# EAGLE design Main_Board (EAGLE 6.0)
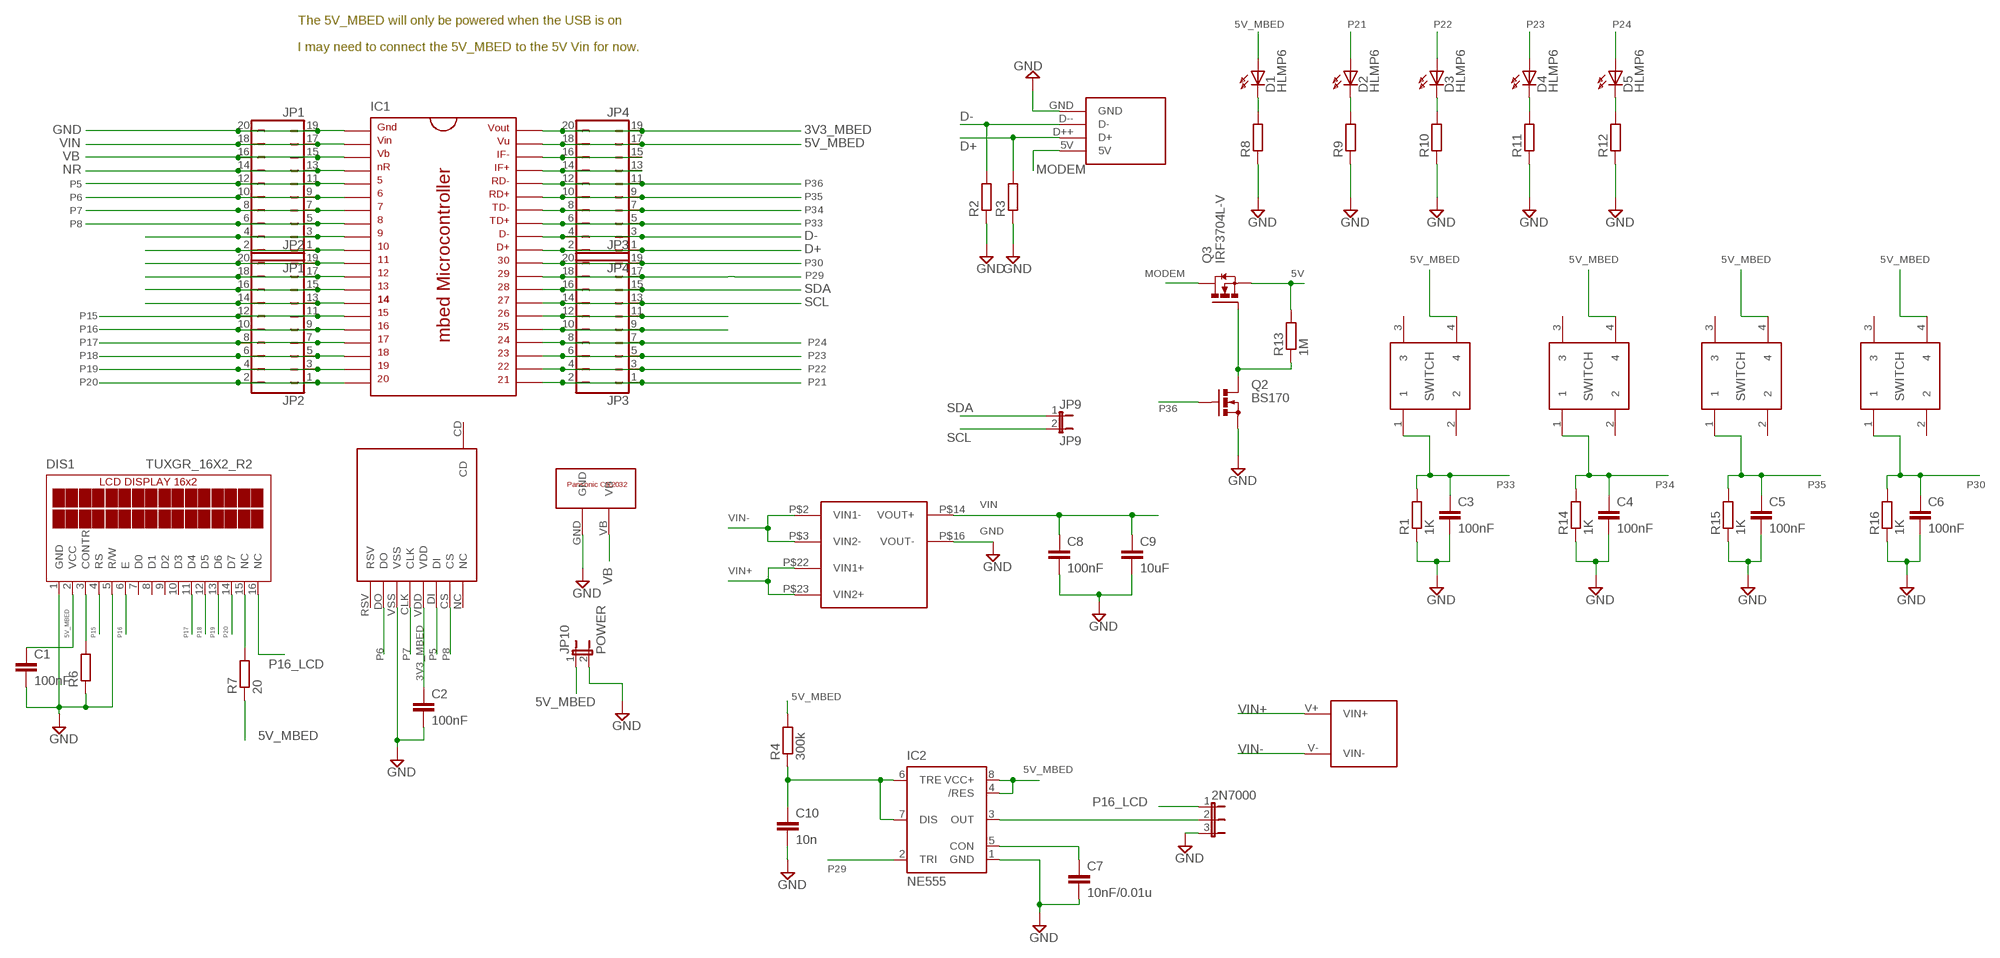
[diagram p0: schematic, sheet 1]

## Parts
2N7000  JP2E  [JP2]
C1  100nF  C5/3  [C5B3]
C2  100nF  C5/3  [C5B3]
C3  100nF  C5/3  [C5B3]
C4  100nF  C5/3  [C5B3]
C5  100nF  C5/3  [C5B3]
C6  100nF  C5/3  [C5B3]
C7  10nF/0.01u  C5/3  [C5B3]
C8  100nF  C5/3  [C5B3]
C9  10uF  C5/3  [C5B3]
C10  10n  C5/3  [C5B3]
D1  HLMP6  [HLMP6]
D2  HLMP6  [HLMP6]
D3  HLMP6  [HLMP6]
D4  HLMP6  [HLMP6]
D5  HLMP6  [HLMP6]
DIS1  TUXGR_16X2_R2  [TUXGR_16X2_R2]
IC1  MBED_MICROCONTROLLER  [DIL40_0.9]
IC2  NE555  [DIL-08]
JP1  JP1  JP10Q  [JP10Q]
JP2  JP2  JP10Q  [JP10Q]
JP3  JP3  JP10Q  [JP10Q]
JP4  JP4  JP10Q  [JP10Q]
JP9  JP9  JP1E  [JP1]
JP10  POWER  JP1E  [JP1]
Q2  BS170  [SOT54E]
Q3  IRF3704L-V  [TO262-V]
R1  1K  R-EU_0411/12  [0411/12]
R2  R-EU_0411/12  [0411/12]
R3  R-EU_0411/12  [0411/12]
R4  300k  R-EU_0411/12  [0411/12]
R6  R-EU_0411/12  [0411/12]
R7  20  R-EU_0411/12  [0411/12]
R8  R-EU_0411/12  [0411/12]
R9  R-EU_0411/12  [0411/12]
R10  R-EU_0411/12  [0411/12]
R11  R-EU_0411/12  [0411/12]
R12  R-EU_0411/12  [0411/12]
R13  1M  R-EU_0411/12  [0411/12]
R14  1K  R-EU_0411/12  [0411/12]
R15  1K  R-EU_0411/12  [0411/12]
R16  1K  R-EU_0411/12  [0411/12]
U$1  USBA_SOCKET  [USBA_SOCKET]
U$2  MICROSD_SOCKET  [MICROSD_SOCKET]
U$3  PANASONIC_CR2032  [PANASONIC_CR2032]
U$4  INPUT_VOLTAGE_CONNECTOR  [INPUT_VOLTAGE_CONNECTOR]
U$5  TACT_SWITCH  [TACT_SWITCH]
U$6  TACT_SWITCH  [TACT_SWITCH]
U$7  TACT_SWITCH  [TACT_SWITCH]
U$8  TACT_SWITCH  [TACT_SWITCH]
U$9  TRACO_ISOLATED_SUPPLY  [TRACO_ISOLATED_SUPPLY]

## Nets
3V3_MBED: C2.1 IC1.40 JP4.19 JP4.20 U$2.VDD
5V: Q3.3(S) R13.2
5V_MBED: C1.1 D1.A DIS1.2(VCC) IC1.39 IC2.4(/RES) IC2.8(VCC+) JP4.17 JP4.18 JP10.1 R4.2 R7.1 U$5.4 U$6.4 U$7.4 U$8.4
D+: IC1.31 JP4.1 JP4.2 R3.2 U$1.D++(D+)
D-: IC1.32 JP4.3 JP4.4 R2.2 U$1.D--(D-)
GND: 2N7000.3 C1.2 C2.2 C3.2 C4.2 C5.2 C6.2 C7.2 C8.2 C9.2 C10.2 DIS1.1(GND) DIS1.5(R/W) IC1.1 IC2.1(GND) JP1.19 JP1.20 JP10.2 Q2.S R1.1 R2.1 R3.1 R6.1 R8.1 R9.1 R10.1 R11.1 R12.1 R14.1 R15.1 R16.1 U$1.GND U$2.VSS U$3.GND U$9.P$16(VOUT-)
MODEM: Q3.2(D) U$1.5V
N$1: D1.K R8.2
N$2: C7.1 IC2.5(CON)
N$3: DIS1.3(CONTR) R6.2
N$4: D2.K R9.2
N$5: Q2.D Q3.1(G) R13.1
N$6: C10.1 IC2.6(TRE) IC2.7(DIS) R4.1
N$7: 2N7000.2 IC2.3(OUT)
N$9: IC1.9 JP1.3 JP1.4
N$10: IC1.10 JP1.1 JP1.2
N$11: IC1.11 JP2.19 JP2.20
N$12: IC1.12 JP2.17 JP2.18
N$13: IC1.13 JP2.15 JP2.16
N$14: IC1.14 JP2.13 JP2.14
N$15: D3.K R10.2
N$16: D4.K R11.2
N$17: D5.K R12.2
N$23: IC1.38 JP4.15 JP4.16
N$24: IC1.37 JP4.13 JP4.14
N$35: IC1.26 JP3.11 JP3.12
N$36: IC1.25 JP3.9 JP3.10
N$45: DIS1.15(NC) R7.2
NR: IC1.4 JP1.13 JP1.14
P5: IC1.5 JP1.11 JP1.12 U$2.DI
P6: IC1.6 JP1.9 JP1.10 U$2.DO
P7: IC1.7 JP1.7 JP1.8 U$2.CLK
P8: IC1.8 JP1.5 JP1.6 U$2.CS
P15: DIS1.4(RS) IC1.15 JP2.11 JP2.12
P16: DIS1.6(E) IC1.16 JP2.9 JP2.10
P16_LCD: 2N7000.1 DIS1.16(NC)
P17: DIS1.11(D4) IC1.17 JP2.7 JP2.8
P18: DIS1.12(D5) IC1.18 JP2.5 JP2.6
P19: DIS1.13(D6) IC1.19 JP2.3 JP2.4
P20: DIS1.14(D7) IC1.20 JP2.1 JP2.2
P21: D2.A IC1.21 JP3.1 JP3.2
P22: D3.A IC1.22 JP3.3 JP3.4
P23: D4.A IC1.23 JP3.5 JP3.6
P24: D5.A IC1.24 JP3.7 JP3.8
P29: IC1.29 IC2.2(TRI) JP3.17 JP3.18
P30: C6.1 IC1.30 JP3.19 JP3.20 R16.2 U$8.1
P33: C3.1 IC1.33 JP4.5 JP4.6 R1.2 U$5.1
P34: C4.1 IC1.34 JP4.7 JP4.8 R14.2 U$6.1
P35: C5.1 IC1.35 JP4.9 JP4.10 R15.2 U$7.1
P36: IC1.36 JP4.11 JP4.12 Q2.G
SCL: IC1.27 JP3.13 JP3.14 JP9.2
SDA: IC1.28 JP3.15 JP3.16 JP9.1
VB: IC1.3 JP1.15 JP1.16 U$3.VB
VIN: C8.1 C9.1 IC1.2 JP1.17 JP1.18 U$9.P$14(VOUT+)
VIN+: U$4.V+(VIN+) U$9.P$22(VIN1+) U$9.P$23(VIN2+)
VIN-: U$4.V-(VIN-) U$9.P$2(VIN1-) U$9.P$3(VIN2-)
Unconnected: DIS1.7(D0) DIS1.8(D1) DIS1.9(D2) DIS1.10(D3) U$2.CD U$2.NC U$2.RSV U$5.2 U$5.3 U$6.2 U$6.3 U$7.2 U$7.3 U$8.2 U$8.3

## Notes on the sheet
- The 5V_MBED will only be powered when the USB is on
- I may need to connect the 5V_MBED to the 5V Vin for now.

## Library data of the parts
2N7000 = jumper:JP2E: JUMPER
C1-C10 = capacitor-wima:C: CAPACITOR naming: grid - package width
D1-D5 = display-hp:HLMP6: LED 2mm horizontal; MF: AGILENT TECHNOLOGIES; MPN: HLMP-6500; OC_FARNELL: 1652490; OC_NEWARK: 40K0088
DIS1 = display-lcd3:TUXGR_16X2_R2: Tuxgraphics LCD display 16x2 characters reflective, without background light Source: tuxgr_12x2_r2.pdf; OC_FARNELL: unknown; OC_NEWARK: unknown
IC1 = mbed-microcontroller:MBED_MICROCONTROLLER: mbed Microcontroller, DIP40, 0.9"
IC2 = st-microelectronics:NE555: General purpose bipolar Timer; MF: Arrow Electronics; MPN: NE555N; OC_FARNELL: 1467742; OC_NEWARK: 89K1486
JP1-JP4 = jumper:JP10Q: JUMPER
JP9 JP10 = jumper:JP1E: JUMPER
Q2 = transistor-small-signal:BS170: N-CHANNEL MOS FET
Q3 = transistor-power:IRF3704: SMPS MOSFET HEXFET® Power MOSFET Source: http://www.irf.com/product-info/datasheets/data/irf3704.pdf
R1-R4 R6-R16 = rcl:R-EU_: RESISTOR, European symbol
U$1 = ekohub2013:USBA_SOCKET
U$2 = ekohub2013:MICROSD_SOCKET
U$3 = Datalogging_Custom_Parts:PANASONIC_CR2032
U$4 = ekohub2013:INPUT_VOLTAGE_CONNECTOR
U$5-U$8 = ekohub2013:TACT_SWITCH
U$9 = ekohub2013:TRACO_ISOLATED_SUPPLY

## Board
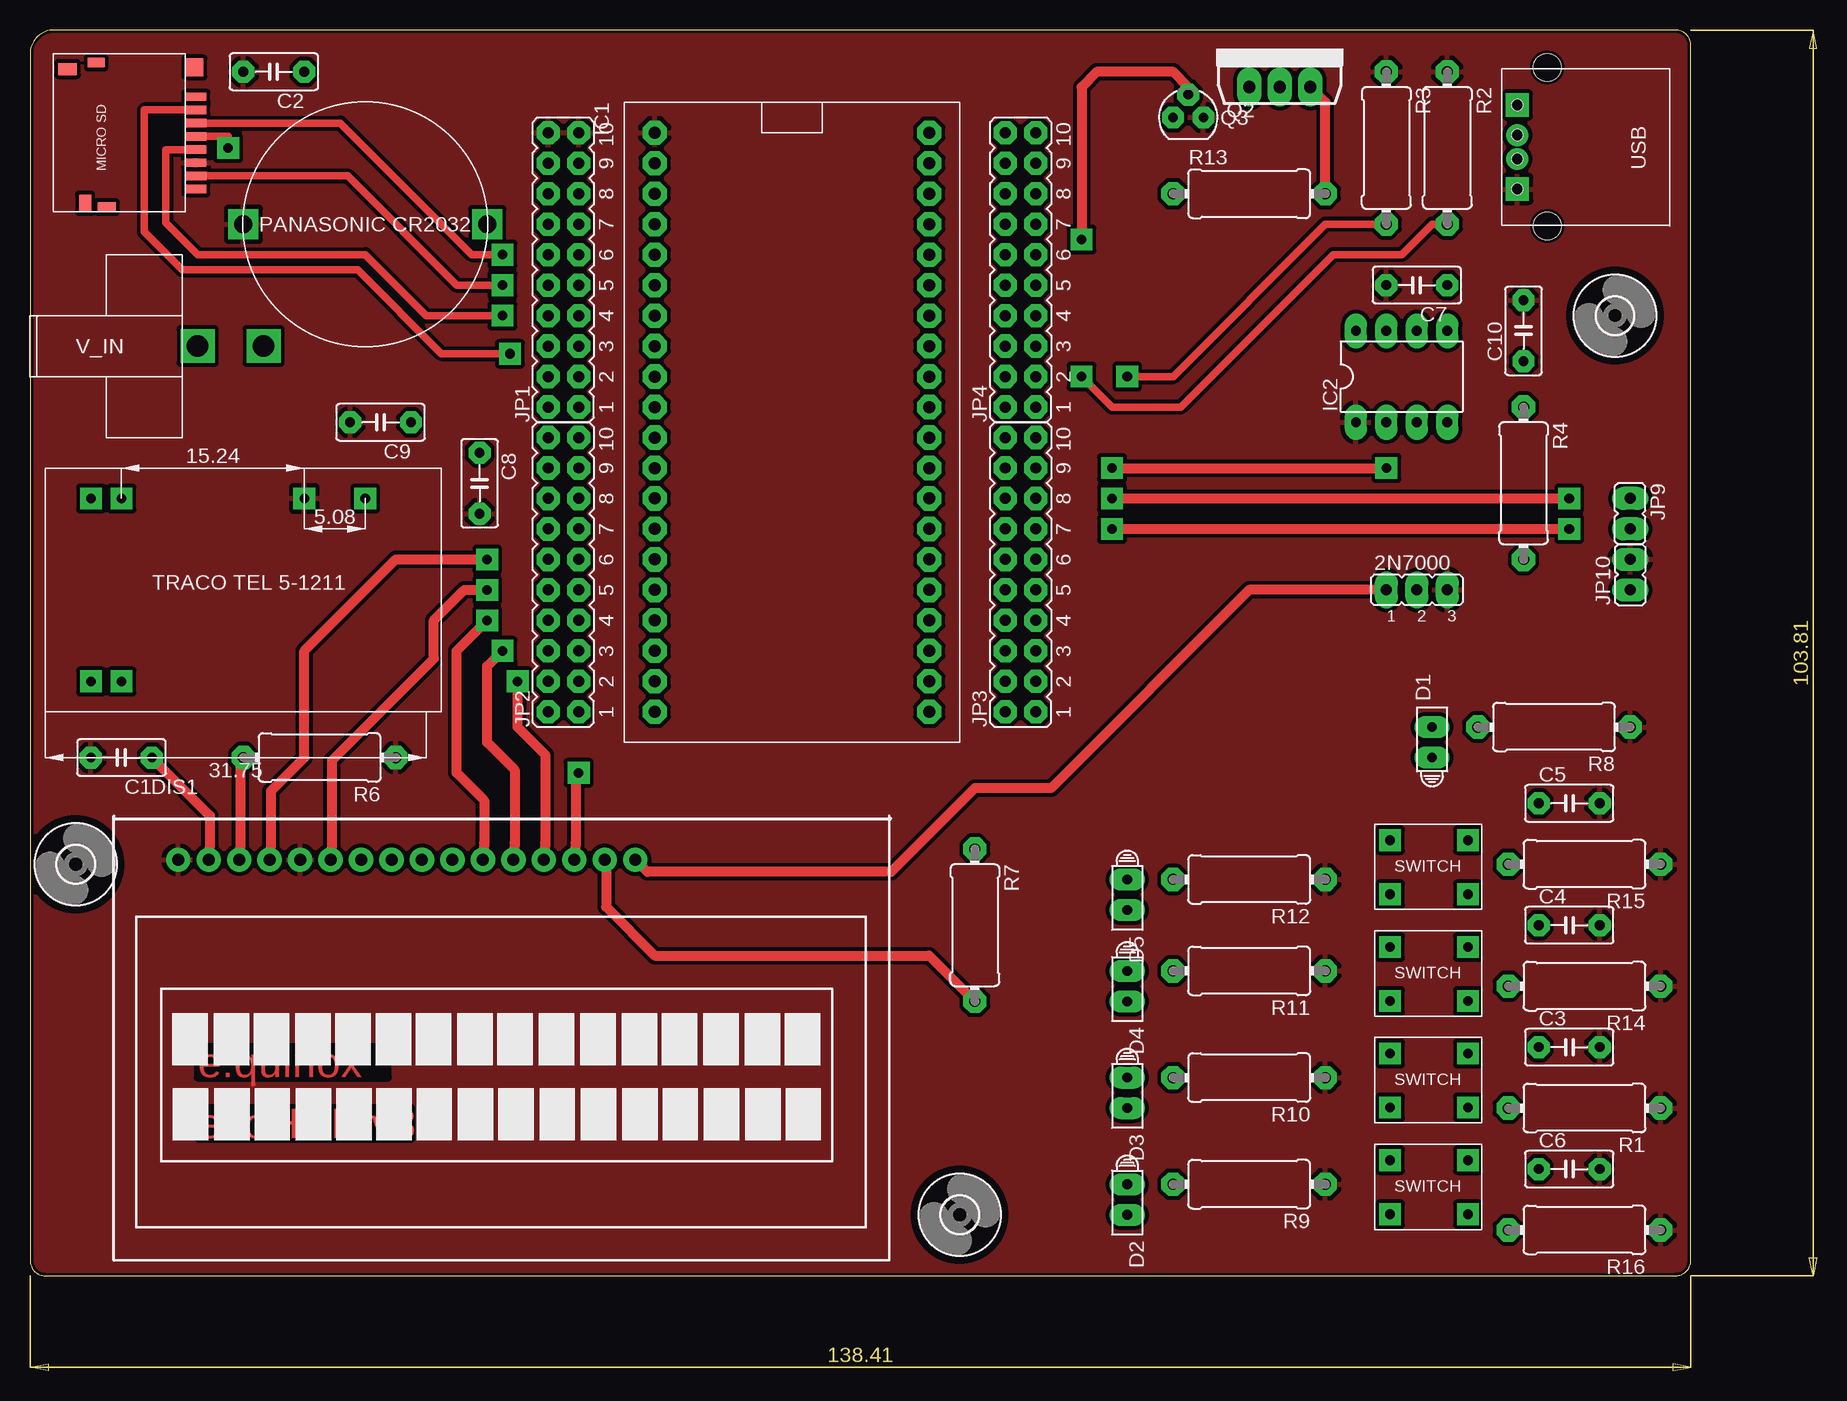
[diagram p1: board, top side]
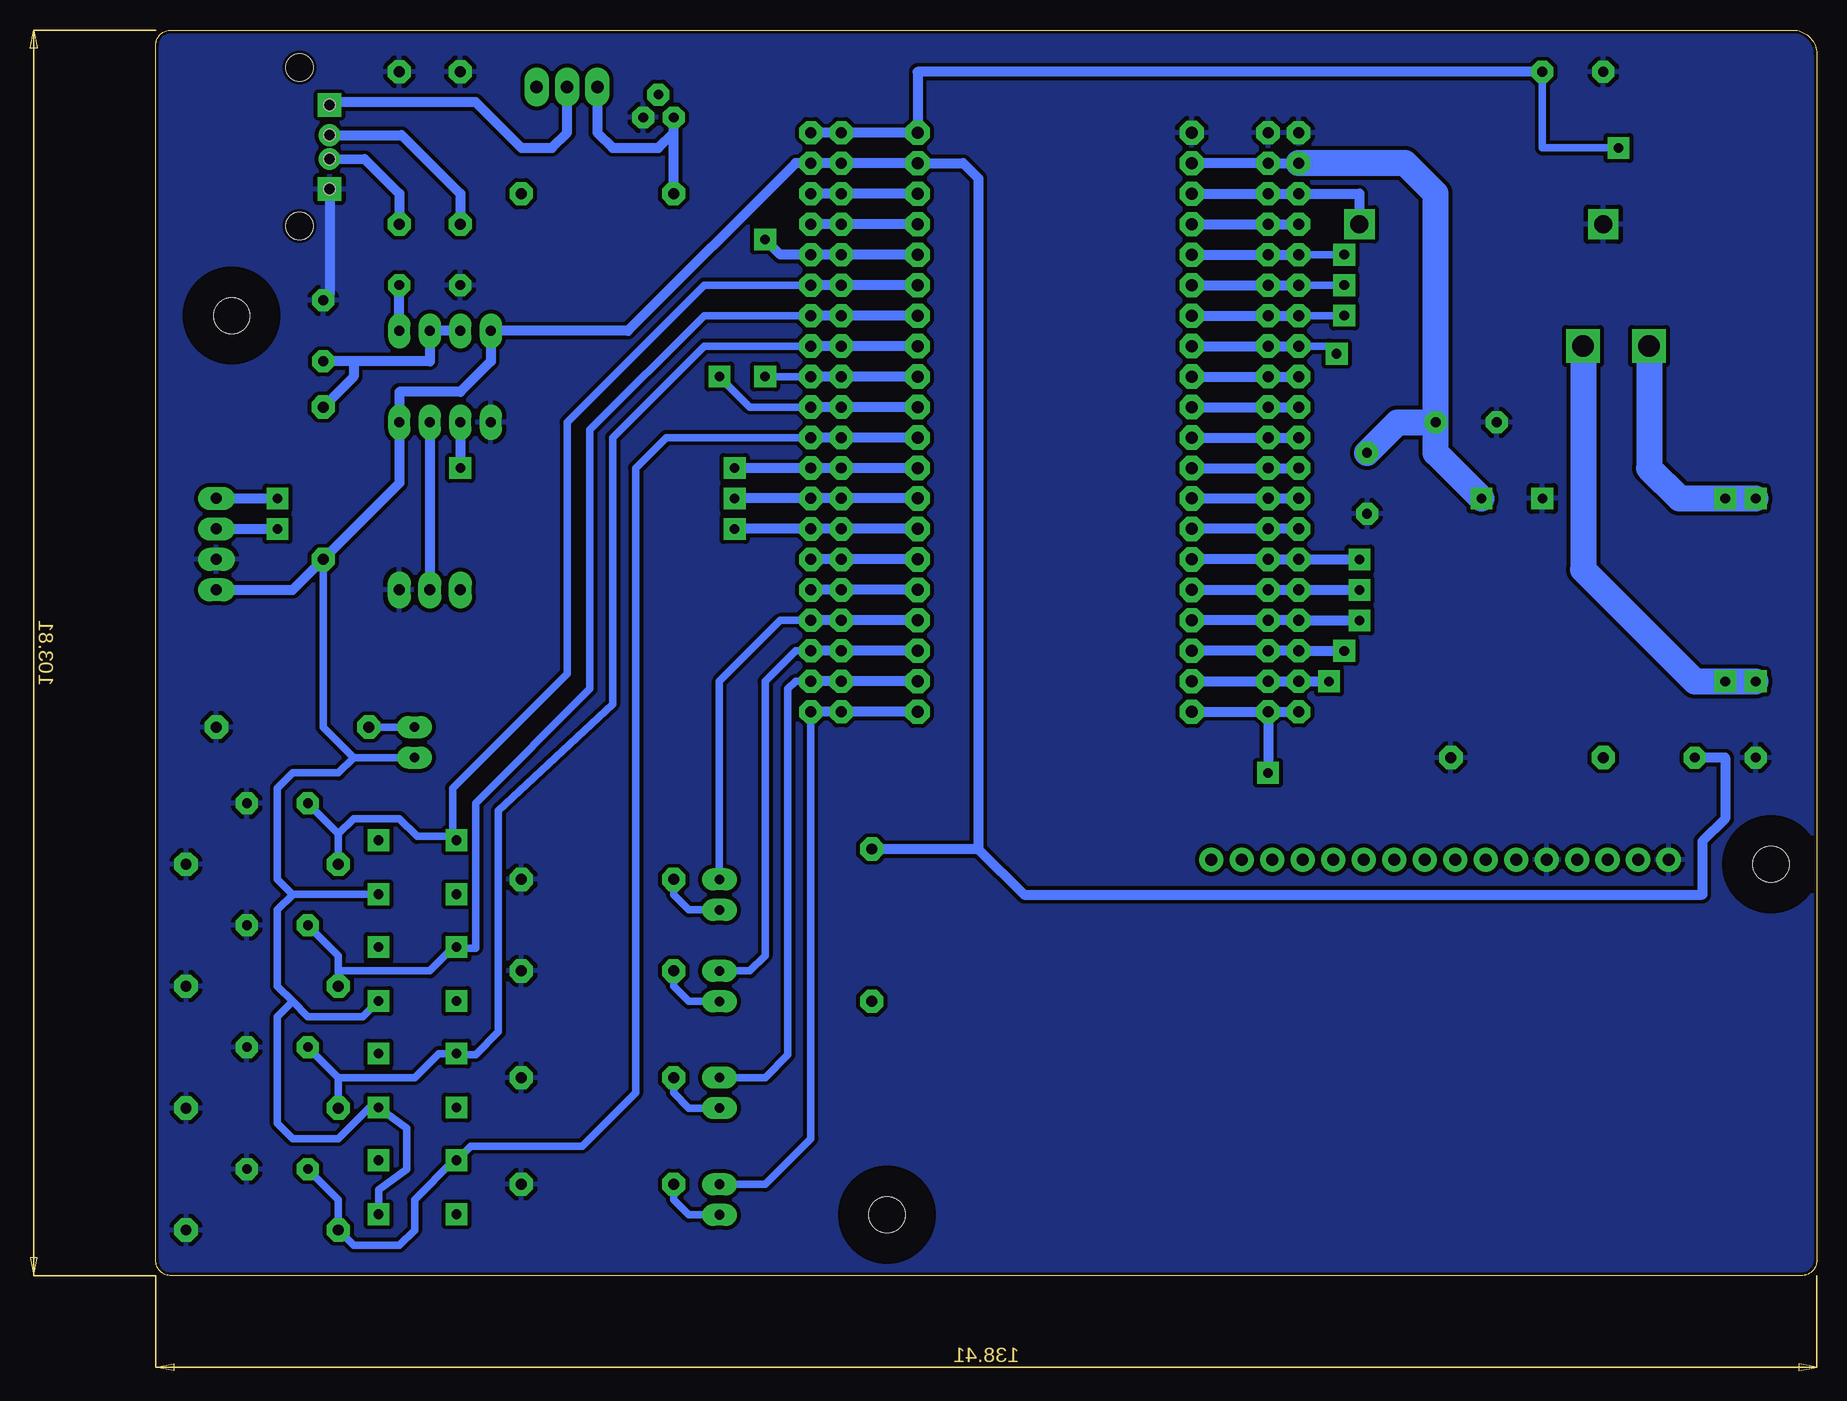
[diagram p2: board, bottom side, seen from below]

Size 138.41 x 103.81 mm. Coordinates in mm from the lower left corner, seen from the top.
Outline: 137.14,103.81 2,103.81 arc90 0,101.81 0,1.27 arc90 1.27,0 137.14,0 arc90 138.41,1.27 138.41,102.54 arc90 137.14,103.81
Copper layers (1*16): Top 0.035mm / dielectric 1.5mm / Bottom 0.035mm
Design rules: minimum track width 16mil, minimum drill 0.7mm, track to track 13mil, track to pad 13mil, pad to pad 13mil, via to via 13mil, smd to smd 0mil, copper to edge 10mil, drill to drill 10mil, minimum pad ring 20mil, minimum via ring 20mil, stop-mask expansion 0mil, vias tented up to drill 0mil, thermal gap 15mil

### Footprints (pad centres in the part's own frame; a part is rotated, then mirrored left to right if it is on the bottom)
JP2 = drill 0.914 long: 1 -2.54,0; 2 0,0; 3 2.54,0
C5B3 = drill 0.813 pad 1.6 octagon: 1 -2.54,0; 2 2.54,0
HLMP6 = drill 0.813 long: A -1.27,0; K 1.27,0
TUXGR_16X2_R2 = drill 1 pad 1.676: 1 0.28,27.05; 2 2.82,27.05; 3 5.36,27.05; 4 7.9,27.05; 5 10.44,27.05; 6 12.98,27.05; 7 15.52,27.05; 8 18.06,27.05; 9 20.6,27.05; 10 23.14,27.05; 11 25.68,27.05; 12 28.22,27.05; 13 30.76,27.05; 14 33.3,27.05; 15 35.84,27.05; 16 38.38,27.05
DIL40_0.9 = drill 1 pad 1.397 octagon: 1 -22.86,-11.43; 2 -20.32,-11.43; 3 -17.78,-11.43; 4 -15.24,-11.43; 5 -12.7,-11.43; 6 -10.16,-11.43; 7 -7.62,-11.43; 8 -5.08,-11.43; 9 -2.54,-11.43; 10 0,-11.43; 11 2.54,-11.43; 12 5.08,-11.43; 13 7.62,-11.43; 14 10.16,-11.43; 15 12.7,-11.43; 16 15.24,-11.43; 17 17.78,-11.43; 18 20.32,-11.43; 19 22.86,-11.43; 20 25.4,-11.43; 21 25.4,11.43; 22 22.86,11.43; 23 20.32,11.43; 24 17.78,11.43; 25 15.24,11.43; 26 12.7,11.43; 27 10.16,11.43; 28 7.62,11.43; 29 5.08,11.43; 30 2.54,11.43; 31 0,11.43; 32 -2.54,11.43; 33 -5.08,11.43; 34 -7.62,11.43; 35 -10.16,11.43; 36 -12.7,11.43; 37 -15.24,11.43; 38 -17.78,11.43; 39 -20.32,11.43; 40 -22.86,11.43
DIL-08 = drill 0.813 long: 1 -3.81,-3.81; 2 -1.27,-3.81; 3 1.27,-3.81; 4 3.81,-3.81; 5 3.81,3.81; 6 1.27,3.81; 7 -1.27,3.81; 8 -3.81,3.81
JP10Q = drill 0.914 octagon: 1 -11.43,-1.27; 2 -11.43,1.27; 3 -8.89,-1.27; 4 -8.89,1.27; 5 -6.35,-1.27; 6 -6.35,1.27; 7 -3.81,-1.27; 8 -3.81,1.27; 9 -1.27,-1.27; 10 -1.27,1.27; 11 1.27,-1.27; 12 1.27,1.27; 13 3.81,-1.27; 14 3.81,1.27; 15 6.35,-1.27; 16 6.35,1.27; 17 8.89,-1.27; 18 8.89,1.27; 19 11.43,-1.27; 20 11.43,1.27
JP1 = drill 0.914 long: 1 0,-1.27; 2 0,1.27
SOT54E = drill 0.813 octagon: D -1.27,0; G 0,1.905; S 1.27,0
TO262-V = drill 1.016 long: 1 -2.54,0; 2 0,0; 3 2.54,0
0411/12 = drill 0.914 octagon: 1 -6.35,0; 2 6.35,0
USBA_SOCKET = drill 0.92 square: 5V 4.85,0.53; GND -2.15,0.53 | drill 0.8: D++ 2.335,0.531; D-- 0.355,0.531 | hole 2.3: -5.23,-1.97; 7.97,-1.97 | hole 0.92: -2.15,0.53; 0.35,0.53; 2.35,0.53; 4.85,0.53
MICROSD_SOCKET = smd 1.45 x 1: CD -5.875,1.75 | smd 1 x 1.55: CD2 5.3,3.225 | smd 0.7 x 1.75: CLK -1.4,-7.475; CS 1.9,-7.475; DI 0.8,-7.475; DO -3.6,-7.475; NC 3,-7.475; RSV -4.7,-7.475; VDD -0.3,-7.475; VSS -2.5,-7.475 | smd 1.5 x 1.5: MOUNT2 5.45,-7.35 | smd 0.8 x 1.5: MOUNT3 -6.2,-0.05 | smd 0.8 x 1.4: MOUNT4 5.85,0.825
PANASONIC_CR2032 = drill 1.5 square: GND -10.16,0; VB 10.16,0
INPUT_VOLTAGE_CONNECTOR = drill 1.8 square: V+ 0,0; V- 5.5,0
TACT_SWITCH = drill 0.8 square: 1 -3.5,2; 2 3,2; 3 -3.5,-2.5; 4 3,-2.5
TRACO_ISOLATED_SUPPLY = drill 0.8 square: P$2 0,0; P$3 2.54,0; P$14 22.86,15.24; P$16 17.78,15.24; P$22 2.54,15.24; P$23 0,15.24
3,0 = hole 3: 0,0

### Placement (x,y rotation side)
2N7000  115.57,57.15 0 top
C1  7.62,43.18 180 top
C2  20.32,100.33 180 top
C3  128.27,19.05 0 top
C4  128.27,29.21 0 top
C5  128.27,39.37 0 top
C6  128.27,8.89 0 top
C7  115.57,82.55 180 top
C8  37.46,66.04 270 top
C9  29.21,71.12 180 top
C10  124.46,78.74 90 top
D1  116.84,44.45 90 top
D2  91.44,6.35 270 top
D3  91.44,15.24 270 top
D4  91.44,24.13 270 top
D5  91.44,31.75 270 top
DIS1  12.07,7.62 0 top
IC1  63.5,72.39 270 top
IC2  114.3,74.93 0 top
JP1  44.45,83.82 90 top
JP2  44.45,58.42 90 top
JP3  82.55,58.42 90 top
JP4  82.55,83.82 90 top
JP9  133.35,63.5 180 top
JP10  133.35,58.42 0 top
Q2  96.52,96.52 0 top
Q3  104.14,99.06 0 top
R1  129.54,13.97 180 top
R2  118.11,93.98 270 top
R3  113.03,93.98 270 top
R4  124.46,66.04 270 top
R6  24.13,43.18 180 top
R7  78.74,29.21 270 top
R8  127,45.72 180 top
R9  101.6,7.62 180 top
R10  101.6,16.51 180 top
R11  101.6,25.4 180 top
R12  101.6,33.02 180 top
R13  101.6,90.17 0 top
R14  129.54,24.13 180 top
R15  129.54,34.29 180 top
R16  129.54,3.81 180 top
U$1  124.46,92.71 90 top
U$2  6.35,95.25 90 top
U$3  27.94,87.63 0 top
U$4  13.97,77.47 0 top
U$5  116.84,16.51 0 top
U$6  116.84,25.4 0 top
U$7  116.84,34.29 0 top
U$8  116.84,7.62 0 top
U$9  5.08,49.53 0 top
U$10  [3,0]  77.47,5.08 0 top
U$11  [3,0]  132.08,80.01 0 top
U$12  [3,0]  3.81,34.29 0 top

### Tracks (layer width: path | path; a pad name or v marks a point on that pad's centre or on a via)
3V3_MBED  (via drill 0.8)
  Top 0.61: U$2.VDD 16.51,94.95 v16.51,93.98
  Bottom 0.61: C2.1 22.86,93.98 v16.51,93.98
  Bottom 0.813: JP4.19 JP4.20 IC1.40 74.93,100.33 C2.1
5V
  Top 0.813: R13.2 107.95,97.79 Q3.3
5V_MBED
  Top 0.813: C1.1 14.99,38.35 14.99,36.04 DIS1.2
  Bottom 0.61: U$8.4 119.84,7.16 117.48,8.89 117.48,12.28 U$5.4 120.61,14.01 123.19,11.43 127,11.43 128.27,12.7 128.27,21.59 127,22.86 | U$7.4 126.96,31.79 127,31.75 | 127,31.75 128.27,30.48 128.27,24.13 127,22.86 | 127,22.86 125.73,21.59 121.15,21.59 U$6.4 | 127,31.75 128.27,33.02 128.27,40.64 127,41.91 123.19,41.91 121.92,43.18 | 121.92,43.18 124.46,45.72 R4.2 | D1.A 121.92,43.18
  Bottom 0.813: 69.85,35.56 69.85,91.44 71.12,92.71 IC1.39 JP4.18 JP4.17 85.09,92.71 99.06,78.74 IC2.8 110.49,76.2 113.03,73.66 118.11,73.66 IC2.4 118.11,66.04 R4.2 127,57.15 JP10.1 | 69.85,35.56 66.04,31.75 9.53,31.75 9.53,36.2 7.62,38.1 7.62,43.18 C1.1 | 69.85,35.56 R7.1
D+  (via drill 0.8)
  Top 0.61: R3.2 107.95,87.63 95.25,74.93 v91.44,74.93
  Bottom 0.61: JP4.1 88.9,72.39 v91.44,74.93
  Bottom 0.813: IC1.31 JP4.2 JP4.1 | U$1.D++ 117.92,95.06 113.03,90.17 R3.2
D-  (via drill 0.8)
  Top 0.61: R2.2 116.84,87.63 114.3,85.09 108.59,85.09 95.89,72.39 90.17,72.39 v87.63,74.93
  Bottom 0.61: JP4.3 v87.63,74.93
  Bottom 0.813: IC1.32 JP4.4 JP4.3 | U$1.D-- 121,93.06 118.11,90.17 R2.2
GND
  Bottom 0.813: U$1.GND 123.93,81.81 C10.2
  pour Top: 136.43,0 2,0 arc-90 0,2 0,102.14 arc-90 2,104.14 136.43,104.14 arc-90 138.43,102.14 138.43,2 arc-90
  pour Bottom: 138.43,102.14 138.45,2.03 arc-91 136.45,0 1.27,0 arc-90 0,1.27 0,102.14 arc-90 2,104.14 135.16,104.14 arc-90
MODEM
  Bottom 0.813: U$1.5V 123.7,97.79 111.76,97.79 107.95,93.98 105.41,93.98 104.14,95.25 Q3.2
N$1
  Bottom 0.61: D1.K R8.2
N$2
  Bottom 0.813: IC2.5 C7.1
N$3
  Top 0.813: R6.2 17.53,43.43 17.53,36.04 DIS1.3
N$4
  Bottom 0.61: D2.K 93.98,5.08 95.25,6.35 R9.2
N$5
  Bottom 0.813: R13.1 95.25,95.25 | 95.25,95.25 Q2.D | Q3.1 101.6,95.25 100.33,93.98 96.52,93.98 95.25,95.25
N$6
  Bottom 0.813: IC2.7 IC2.6 115.57,76.2 121.92,76.2 | 121.92,76.2 C10.1 | 121.92,76.2 121.92,74.93 R4.1
N$7
  Bottom 0.813: IC2.3 2N7000.2
N$9
  Bottom 0.813: IC1.9 JP1.3 JP1.4
N$10
  Bottom 0.813: IC1.10 JP1.1 JP1.2
N$11
  Bottom 0.813: IC1.11 JP2.19 JP2.20
N$12
  Bottom 0.813: IC1.12 JP2.17 JP2.18
N$13
  Bottom 0.813: IC1.13 JP2.15 JP2.16
N$14
  Bottom 0.813: IC1.14 JP2.13 JP2.14
N$15
  Bottom 0.61: D3.K 93.98,13.97 95.25,15.24 R10.2
N$16
  Bottom 0.61: D4.K 93.98,22.86 95.25,24.13 R11.2
N$17
  Bottom 0.61: D5.K 93.98,30.48 95.25,31.75 R12.2
N$23
  Bottom 0.813: IC1.38 JP4.16 JP4.15
N$24
  Bottom 0.813: IC1.37 JP4.14 JP4.13
N$35
  Bottom 0.813: IC1.26 JP3.12 JP3.11
N$36
  Bottom 0.813: IC1.25 JP3.10 JP3.9
N$45
  Top 0.813: DIS1.15 48.01,34.77 48.01,30.73 52.07,26.67 74.93,26.67 R7.2
NR
  Bottom 0.813: IC1.4 JP1.13 JP1.14
P5  (via drill 0.8)
  Top 0.61: U$2.DI 25.87,96.05 36.83,85.09 v39.37,85.09
  Bottom 0.61: JP1.12 v39.37,85.09
  Bottom 0.813: IC1.5 JP1.11 JP1.12
P6  (via drill 0.8)
  Top 0.61: U$2.DO 26.46,91.65 35.56,82.55 v39.37,82.55
  Bottom 0.61: JP1.10 v39.37,82.55
  Bottom 0.813: IC1.6 JP1.9 JP1.10
P7  (via drill 0.8)
  Top 0.61: U$2.CLK 11.3,93.85 11.3,87.76 13.97,85.09 27.94,85.09 33.02,80.01 v39.37,80.01
  Bottom 0.61: JP1.8 v39.37,80.01
  Bottom 0.813: IC1.7 JP1.7 JP1.8
P8  (via drill 0.8)
  Top 0.61: U$2.CS 12.06,97.15 9.53,97.16 9.53,87 12.7,83.82 27.3,83.82 34.29,76.83 v40,76.83
  Bottom 0.61: JP1.6 40.64,77.47 v40,76.83
  Bottom 0.813: IC1.8 JP1.5 JP1.6
P15  (via drill 0.8)
  Top 0.813: v38.1,59.69 30.48,59.69 22.86,52.07 22.86,43.18 20.07,40.39 20.07,36.04 DIS1.4
  Bottom 0.813: IC1.15 JP2.11 JP2.12 v38.1,59.69
P16  (via drill 0.8)
  Top 0.813: v38.1,57.15 36.2,57.15 33.65,54.61 33.65,51.43 25.15,42.93 25.15,36.04 DIS1.6
  Bottom 0.813: IC1.16 JP2.9 JP2.10 v38.1,57.15
P16_LCD
  Top 0.813: 2N7000.1 101.6,57.15 85.09,40.64 78.74,40.64 71.76,33.66 51.45,33.66 50.45,34.66 DIS1.16
P17  (via drill 0.8)
  Top 0.813: v38.1,54.61 35.56,52.07 35.56,41.91 37.85,39.62 37.85,36.04 DIS1.11
  Bottom 0.813: IC1.17 JP2.7 JP2.8 v38.1,54.61
P18  (via drill 0.8)
  Top 0.813: v39.37,52.07 38.1,50.8 38.1,44.45 40.39,42.16 40.39,36.04 DIS1.12
  Bottom 0.813: IC1.18 JP2.5 JP2.6 v39.37,52.07
P19  (via drill 0.8)
  Top 0.813: v40.64,49.53 40.64,45.72 42.93,43.43 42.93,36.04 DIS1.13
  Bottom 0.813: IC1.19 JP2.3 JP2.4 v40.64,49.53
P20  (via drill 0.8)
  Top 0.813: v45.72,41.91 45.47,41.66 45.47,36.04 DIS1.14
  Bottom 0.813: IC1.20 JP2.1 | JP2.1 JP2.2 | JP2.1 v45.72,41.91
P21
  Bottom 0.61: JP3.1 83.82,11.43 87.63,7.62 D2.A
  Bottom 0.813: IC1.21 JP3.2 JP3.1
P22
  Bottom 0.61: JP3.3 85.09,49.53 85.73,48.89 85.73,18.42 87.63,16.51 D3.A
  Bottom 0.813: IC1.22 JP3.4 JP3.3
P23
  Bottom 0.61: JP3.5 85.09,52.07 87.63,49.53 87.63,26.67 88.9,25.4 D4.A
  Bottom 0.813: IC1.23 JP3.6 JP3.5
P24
  Bottom 0.61: JP3.7 86.36,54.61 91.44,49.53 D5.A
  Bottom 0.813: IC1.24 JP3.8 JP3.7
P29  (via drill 0.8)
  Top 0.813: v90.17,67.31 v113.03,67.31
  Bottom 0.813: IC1.29 JP3.18 JP3.17 v90.17,67.31 | IC2.2 v113.03,67.31
P30
  Bottom 0.61: JP3.19 95.89,69.85 98.42,67.31 98.42,15.24 102.87,10.79 112.17,10.79 U$8.1 113.57,9.62 116.84,6.35 116.84,3.81 118.11,2.54 121.92,2.54 R16.2 123.19,6.35 C6.1
  Bottom 0.813: IC1.30 JP3.20 JP3.19
P33
  Bottom 0.61: JP4.5 92.71,77.47 100.33,69.85 100.33,47.62 109.86,38.73 109.86,20.32 111.76,18.42 113.25,18.42 U$5.1 114.84,18.51 116.84,16.51 123.19,16.51 | R1.2 123.19,16.51 | 123.19,16.51 C3.1
  Bottom 0.813: IC1.33 JP4.6 JP4.5
P34
  Bottom 0.61: JP4.7 92.71,80.01 102.23,70.48 102.23,48.89 111.76,39.37 111.76,27.3 113.25,27.3 U$6.1 113.57,27.4 115.57,25.4 123.19,25.4 | R14.2 123.19,25.4 | 123.19,25.4 123.19,26.67 C4.1
  Bottom 0.813: IC1.34 JP4.8 JP4.7
P35
  Bottom 0.61: JP4.9 92.71,82.55 104.14,71.12 104.14,50.16 113.67,40.64 113.67,36.61 | 113.67,36.61 U$7.1 | R15.2 123.19,36.83 | 123.19,36.83 C5.1 | 113.67,36.61 116.62,36.61 118.11,38.1 121.92,38.1 123.19,36.83
  Bottom 0.813: IC1.35 JP4.10 JP4.9
P36  (via drill 0.8)
  Top 0.813: Q2.G 96.52,99.06 95.25,100.33 88.9,100.33 87.63,99.06 v87.63,86.36
  Bottom 0.813: IC1.36 JP4.12 JP4.11 86.36,85.09 v87.63,86.36
SCL  (via drill 0.8)
  Top 0.813: v90.17,62.23 v128.27,62.23
  Bottom 0.813: IC1.27 JP3.14 JP3.13 v90.17,62.23 | JP9.2 v128.27,62.23
SDA  (via drill 0.8)
  Top 0.813: v90.17,64.77 v128.27,64.77
  Bottom 0.813: IC1.28 JP3.16 JP3.15 v90.17,64.77 | JP9.1 v128.27,64.77
VB
  Bottom 0.813: IC1.3 JP1.15 JP1.16 38.1,90.17 U$3.VB
VIN
  Bottom 0.813: JP1.18 JP1.17 IC1.2
  Bottom 2.184: U$9.P$14 28.57,65.41 31.75,68.58 C9.1 | C8.1 34.92,71.12 C9.1 | C9.1 31.75,90.17 34.29,92.71 JP1.18
VIN+
  Bottom 2.184: U$4.V+ 13.97,67.31 11.43,64.77 U$9.P$22 U$9.P$23
VIN-
  Bottom 2.184: U$4.V- 19.47,58.84 10.16,49.53 U$9.P$3 U$9.P$2

### Text on the board
Top: e.quinox | ekoHUB v3